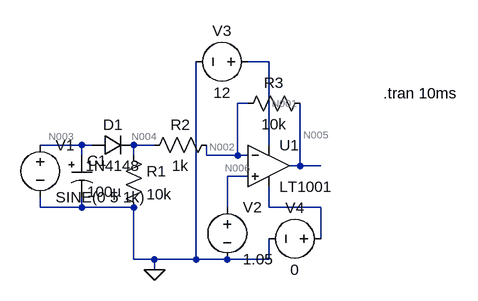
[diagram p0: schematic myadc.asc]
myadc.asc, the LTspice schematic file:
Version 4
SHEET 1 880 680
WIRE 416 -368 384 -368
WIRE 384 -304 368 -304
WIRE 128 -240 64 -240
WIRE 144 -240 128 -240
WIRE 240 -240 208 -240
WIRE 416 -240 416 -368
WIRE 128 -224 128 -240
WIRE 208 -224 208 -240
WIRE 320 -224 320 -240
WIRE 368 -224 368 -304
WIRE 368 -224 320 -224
WIRE 384 -224 368 -224
WIRE 464 -208 464 -304
WIRE 464 -208 448 -208
WIRE 496 -208 464 -208
WIRE 384 -192 352 -192
WIRE 64 -144 64 -160
WIRE 128 -144 128 -160
WIRE 128 -144 64 -144
WIRE 208 -144 128 -144
WIRE 352 -144 352 -192
WIRE 416 -144 416 -176
WIRE 496 -144 416 -144
WIRE 496 -96 496 -144
WIRE 208 -64 208 -144
WIRE 240 -64 208 -64
WIRE 304 -64 304 -368
WIRE 304 -64 240 -64
WIRE 352 -64 304 -64
WIRE 416 -64 416 -96
WIRE 416 -64 352 -64
WIRE 240 -48 240 -64
FLAG 240 -48 0
SYMBOL diode 144 -224 R270
WINDOW 0 32 32 VTop 2
WINDOW 3 0 32 VBottom 2
SYMATTR InstName D1
SYMATTR Value 1N4148
SYMBOL res 192 -240 R0
SYMATTR InstName R1
SYMATTR Value 10k
SYMBOL res 336 -256 R90
WINDOW 0 0 56 VBottom 2
WINDOW 3 32 56 VTop 2
SYMATTR InstName R2
SYMATTR Value 1k
SYMBOL res 480 -320 R90
WINDOW 0 0 56 VBottom 2
WINDOW 3 32 56 VTop 2
SYMATTR InstName R3
SYMATTR Value 10k
SYMBOL OpAmps\\LT1001 416 -272 R0
SYMATTR InstName U1
SYMBOL voltage 64 -256 R0
WINDOW 123 0 0 Left 0
WINDOW 39 0 0 Left 0
SYMATTR InstName V1
SYMATTR Value SINE(0 5 1k)
SYMBOL voltage 352 -160 R0
SYMATTR InstName V2
SYMATTR Value 1.05
SYMBOL voltage 400 -368 R90
WINDOW 0 -32 56 VBottom 2
WINDOW 3 32 56 VTop 2
SYMATTR InstName V3
SYMATTR Value 12
SYMBOL voltage 512 -96 R90
WINDOW 0 -32 56 VBottom 2
WINDOW 3 32 56 VTop 2
SYMATTR InstName V4
SYMATTR Value 0
SYMBOL polcap 112 -224 R0
WINDOW 3 24 56 Left 2
SYMATTR Value 100µ
SYMATTR InstName C1
SYMATTR Description Capacitor
SYMATTR Type cap
SYMATTR SpiceLine V=6.3 Irms=0 Rser=4 Lser=0 mfg="AVX" pn="TAJA106M006" type="Tantalum"
TEXT 592 -320 Left 2 !.tran 10ms

The netlist it stands for:
* myadc.asc
D1 N003 N004 1N4148
R1 N004 0 10k
R2 N002 N004 1k
R3 N005 N002 10k
XU1 N006 N002 N001 N007 N005 LT1001  ; pins In+ In- V+ V- OUT
V1 N003 0 SINE(0 5 1k)
V2 N006 0 1.05
V3 N001 0 12
V4 N007 0 0
C1 N003 0 100µ V=6.3 Irms=0 Rser=4 Lser=0 mfg="AVX" pn="TAJA106M006" type="Tantalum"
.model D D
.lib standard.dio
.tran 10ms
.lib LTC.lib
.backanno
.end

* Results of the author's LTspice run, read from the files saved beside the schematic
* Operating Point, zero values left out:
*   V(n004) = 955.1 mV
*   V(n002) = 1.051 V
*   V(n005) = 2.006 V
*   V(n006) = 1.05 V
*   V(n001) = 12 V
*   I(D1) = -2.521 nA
*   I(R3) = 95.52 µA
*   I(R2) = 95.52 µA
*   I(R1) = 95.51 µA
*   I(V4) = 2.202 mA
*   I(V3) = -2.298 mA
*   I(V2) = 17.65 pA
*   I(V1) = 2.521 nA
*   Ix(u1:1) = -17.65 pA
*   Ix(u1:3) = 2.298 mA
*   Ix(u1:4) = -2.202 mA
*   Ix(u1:5) = -95.52 µA
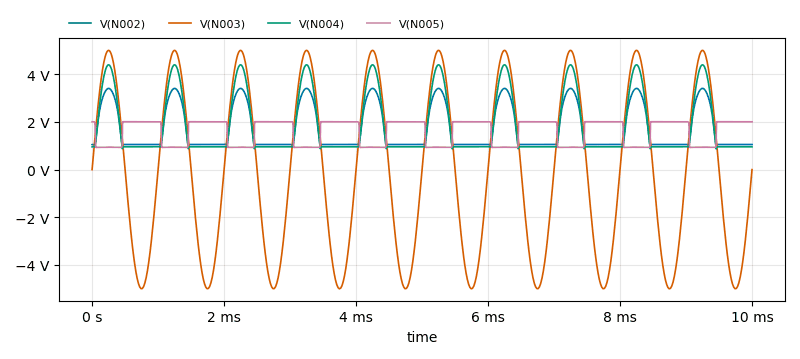
[diagram p1: Transient Analysis of myadc.asc, plotted from the saved traces]
* Transient Analysis, 1 run:
*   V(N002): min 912.7 mV, max 3.404 V, average 1.707 V, rms 1.937 V, last 1.051 V
*   V(N003): min -4.999 V, max 5 V, average 1.502 mV, rms 3.536 V, last 0 V
*   V(N004): min 870.2 mV, max 4.394 V, average 1.858 V, rms 2.256 V, last 955.2 mV
*   V(N005): min 930.7 mV, max 2.007 V, average 1.568 V, rms 1.653 V, last 2.005 V